# EAGLE design haystack_motor (EAGLE 9.1.0)
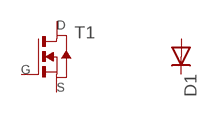
[diagram p0: schematic, sheet 1]

## Parts
D1  DIODESOD123  [SOD123]
T1  NMOSFETSOT23  [SOT-23]
Unconnected: D1.ANODE(A) D1.CATHODE(C) T1.1(D) T1.2(S) T1.3(G)

## Library data of the parts
D1 = fab :DIODE: DIODE high speed (Philips)
T1 = fab :NMOSFET: MOS FET

## Board
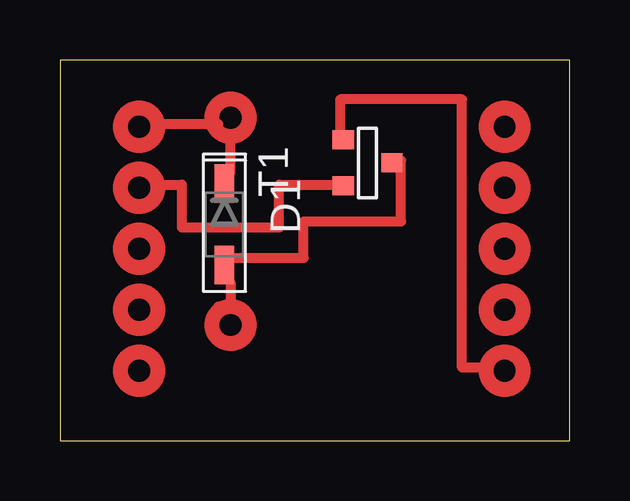
[diagram p1: board, top side]
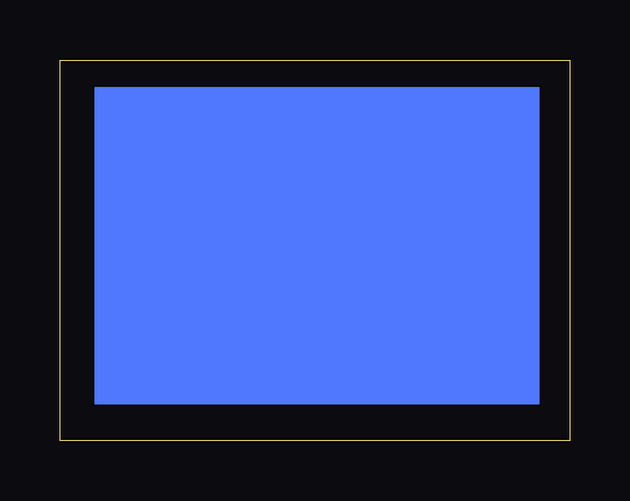
[diagram p2: board, bottom side, seen from below]

Size 21.26 x 15.87 mm. Coordinates in mm from the lower left corner, seen from the top.
Outline: 0,0 21.26,0 21.26,15.87 0,15.87 0,0
Copper layers (1*16): Top 0.035mm / dielectric 1.5mm / Bottom 0.035mm
Design rules "default": minimum track width 6mil, minimum drill 0.35mm, track to track 6mil, track to pad 6mil, pad to pad 6mil, via to via 6mil, smd to smd 6mil, copper to edge 40mil, drill to drill 6mil, minimum pad ring 10mil, minimum via ring 8mil, stop-mask expansion 4mil, vias tented up to drill 0mil, thermal gap 10mil

### Footprints (pad centres in the part's own frame; a part is rotated, then mirrored left to right if it is on the bottom)
SOD123 = smd 1.6 x 0.8: ANODE 1.7,0; CATHODE -1.7,0
SOT-23 = smd 0.787 x 0.889: 1 0.025,-1.016; 2 -0.94,1.016; 3 0.991,1.016

### Placement (x,y rotation side)
D1  6.86,9.02 270 top
T1  12.83,11.56 90 top

### Tracks (layer width: path | path; a pad name or v marks a point on that pad's centre or on a via)
N$1
  Top 0.406: 17.78,3.05 16.76,3.05 16.76,14.22 11.68,14.22 11.68,12.7
N$2
  Top 0.406: 7.11,7.62 10.16,7.62 10.16,9.14 14.22,9.14 14.22,11.68
N$3
  Top 0.406: 4.06,10.67 5.08,10.67 5.08,8.89 9.14,8.89 9.14,10.67 11.68,10.67
N$4
  Top 0.406: 4.06,13.21 6.6,13.21
N$5
  Top 0.406: 7.11,6.6 7.11,5.59 6.6,5.59
N$6
  Top 0.406: 7.11,11.18 7.11,12.7
(copper drawn outside any net)
  shapes: Bottom area x1, Top circle x13